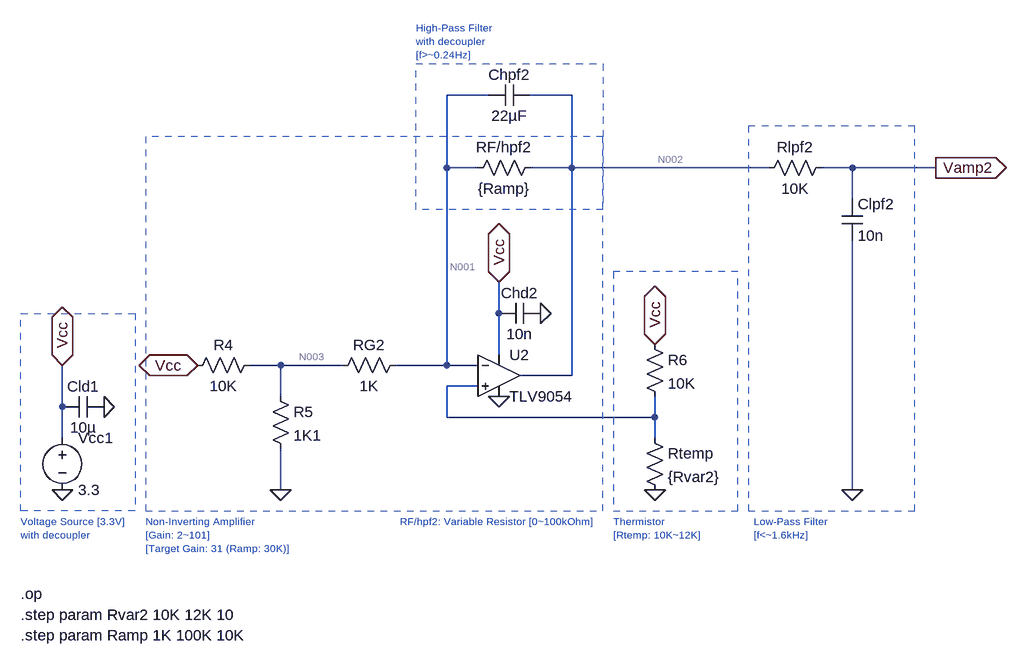
[diagram p0: schematic Project_3_TempSensor.asc]
* Project_3_TempSensor.asc
* U2: TLV9054 (symbol TLV9054 not available, pins judged from their places): In+=N004 In-=N001 V+=Vcc V-=0 OUT=N002
Chd2 0 Vcc 10n
R6 Vcc N004 10K
Rtemp N004 0 {Rvar2}
RF/hpf2 N002 N001 {Ramp}
Chpf2 N002 N001 22µF
RG2 N001 N003 1K
R5 N003 0 1K1
R4 N003 Vcc 10K
Vcc1 Vcc 0 3.3
Cld1 0 Vcc 10µ
Clpf2 Vamp2 0 10n
Rlpf2 Vamp2 N002 10K
.step param Rvar2 10K 12K 10
* Voltage Source [3.3V]
* with decoupler
* Low-Pass Filter
* [f<~1.6kHz]
* High-Pass Filter
* with decoupler
* [f>~0.24Hz]
* Thermistor
* [Rtemp: 10K~12K]
.op
.step param Ramp 1K 100K 10K
* Non-Inverting Amplifier
* [Gain: 2~101]
* [Target Gain: 31 (Ramp: 30K)]
* RF/hpf2: Variable Resistor [0~100kOhm]
.backanno
.end

* Results of the author's LTspice run, read from the files saved beside the schematic
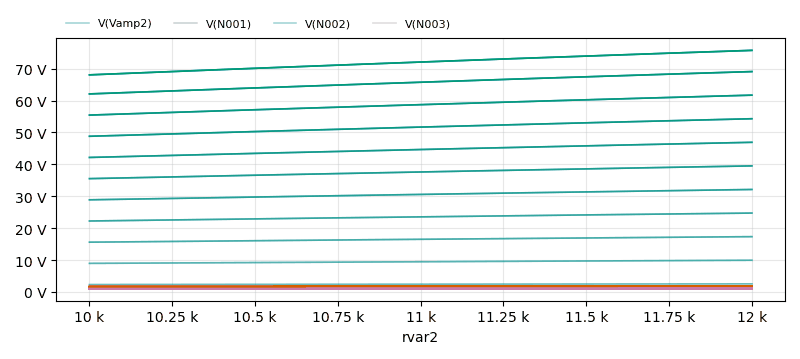
[diagram p1: Operating Point of Project_3_TempSensor.asc, plotted from the saved traces]
* Operating Point, 11 runs:
*   V(Vamp2) [run 1]: 2.314 V at rvar2=10 k, 2.539 V at rvar2=12 k, min 2.314 V, max 2.539 V
*   V(Vamp2) [run 2]: 8.957 V at rvar2=10 k, 9.935 V at rvar2=12 k, min 8.957 V, max 9.935 V
*   V(Vamp2) [run 3]: 15.6 V at rvar2=10 k, 17.33 V at rvar2=12 k, min 15.6 V, max 17.33 V
*   V(Vamp2) [run 4]: 22.24 V at rvar2=10 k, 24.72 V at rvar2=12 k, min 22.24 V, max 24.72 V
*   V(Vamp2) [run 5]: 28.88 V at rvar2=10 k, 32.12 V at rvar2=12 k, min 28.88 V, max 32.12 V
*   V(Vamp2) [run 6]: 35.52 V at rvar2=10 k, 39.51 V at rvar2=12 k, min 35.52 V, max 39.51 V
*   V(Vamp2) [run 7]: 42.16 V at rvar2=10 k, 46.9 V at rvar2=12 k, min 42.16 V, max 46.9 V
*   V(Vamp2) [run 8]: 48.8 V at rvar2=10 k, 54.3 V at rvar2=12 k, min 48.8 V, max 54.3 V
*   V(N001) [run 1]: 1.65 V at rvar2=10 k, 1.8 V at rvar2=12 k, min 1.65 V, max 1.8 V
*   V(N001) [run 2]: 1.65 V at rvar2=10 k, 1.8 V at rvar2=12 k, min 1.65 V, max 1.8 V
*   V(N001) [run 3]: 1.65 V at rvar2=10 k, 1.799 V at rvar2=12 k, min 1.65 V, max 1.799 V
*   V(N001) [run 4]: 1.649 V at rvar2=10 k, 1.799 V at rvar2=12 k, min 1.649 V, max 1.799 V
*   V(N001) [run 5]: 1.649 V at rvar2=10 k, 1.799 V at rvar2=12 k, min 1.649 V, max 1.799 V
*   V(N001) [run 6]: 1.649 V at rvar2=10 k, 1.799 V at rvar2=12 k, min 1.649 V, max 1.799 V
*   V(N001) [run 7]: 1.649 V at rvar2=10 k, 1.799 V at rvar2=12 k, min 1.649 V, max 1.799 V
*   V(N001) [run 8]: 1.649 V at rvar2=10 k, 1.799 V at rvar2=12 k, min 1.649 V, max 1.799 V
*   V(N002) [run 1]: 2.314 V at rvar2=10 k, 2.539 V at rvar2=12 k, min 2.314 V, max 2.539 V
*   V(N002) [run 2]: 8.957 V at rvar2=10 k, 9.935 V at rvar2=12 k, min 8.957 V, max 9.935 V
*   V(N002) [run 3]: 15.6 V at rvar2=10 k, 17.33 V at rvar2=12 k, min 15.6 V, max 17.33 V
*   V(N002) [run 4]: 22.24 V at rvar2=10 k, 24.72 V at rvar2=12 k, min 22.24 V, max 24.72 V
*   V(N002) [run 5]: 28.88 V at rvar2=10 k, 32.12 V at rvar2=12 k, min 28.88 V, max 32.12 V
*   V(N002) [run 6]: 35.52 V at rvar2=10 k, 39.51 V at rvar2=12 k, min 35.52 V, max 39.51 V
*   V(N002) [run 7]: 42.16 V at rvar2=10 k, 46.9 V at rvar2=12 k, min 42.16 V, max 46.9 V
*   V(N002) [run 8]: 48.8 V at rvar2=10 k, 54.3 V at rvar2=12 k, min 48.8 V, max 54.3 V
*   V(N003) [run 1]: 985.3 mV at rvar2=10 k, 1.06 V at rvar2=12 k, min 985.3 mV, max 1.06 V
*   V(N003) [run 2]: 985.3 mV at rvar2=10 k, 1.06 V at rvar2=12 k, min 985.3 mV, max 1.06 V
*   V(N003) [run 3]: 985.3 mV at rvar2=10 k, 1.06 V at rvar2=12 k, min 985.3 mV, max 1.06 V
*   V(N003) [run 4]: 985.2 mV at rvar2=10 k, 1.06 V at rvar2=12 k, min 985.2 mV, max 1.06 V
*   V(N003) [run 5]: 985.2 mV at rvar2=10 k, 1.06 V at rvar2=12 k, min 985.2 mV, max 1.06 V
*   V(N003) [run 6]: 985.2 mV at rvar2=10 k, 1.06 V at rvar2=12 k, min 985.2 mV, max 1.06 V
*   V(N003) [run 7]: 985.1 mV at rvar2=10 k, 1.06 V at rvar2=12 k, min 985.1 mV, max 1.06 V
*   V(N003) [run 8]: 985.1 mV at rvar2=10 k, 1.06 V at rvar2=12 k, min 985.1 mV, max 1.06 V